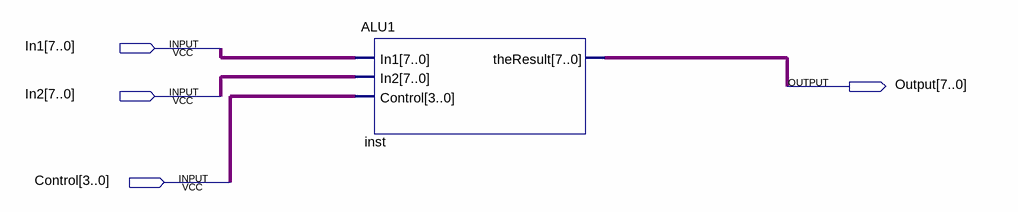
[diagram p0: schematic sheet]
// Quartus schematic lab_n.bdf as structural Verilog: 1 symbols, 4 pins
module lab_n (
  input  [7:0] In1,
  input  [7:0] In2,
  input  [3:0] Control,
  output [7:0] Output
);

  ALU1 inst (.In1(In1), .In2(In2), .Control(Control), .theResult(Output));
endmodule
